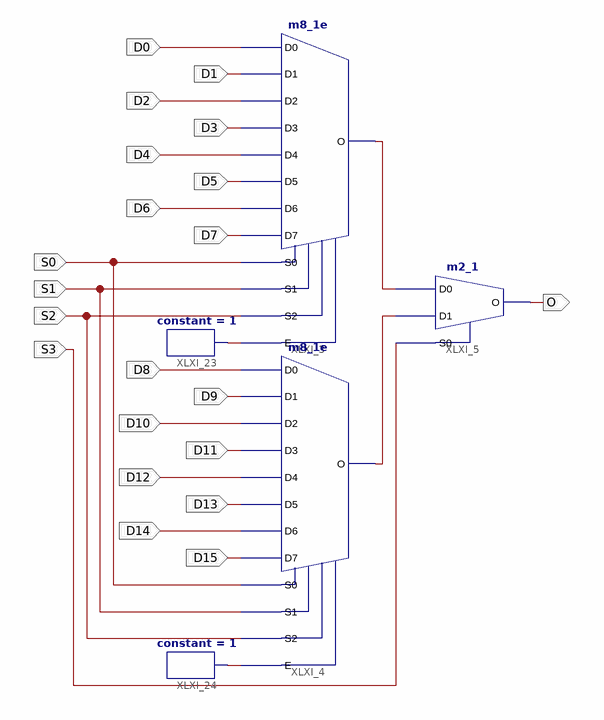
[diagram p0: schematic sheet 1]
// Xilinx ISE schematic Rom16x1.sch (virtex6) as structural Verilog: 5 symbols, 21 ports
module Rom16x1 (
  input  D1,
  input  D0,
  input  D2,
  input  D3,
  input  D4,
  input  D5,
  input  D6,
  input  D7,
  input  D8,
  input  D9,
  input  D10,
  input  D11,
  input  D12,
  input  D13,
  input  D14,
  input  D15,
  input  S0,
  input  S1,
  input  S2,
  input  S3,
  output O
);

  wire XLXN_1, XLXN_2, XLXN_20, XLXN_21;

  m8_1e XLXI_3 (
    .D0(D0), .D1(D1), .D2(D2), .D3(D3), .D4(D4), .D5(D5), .D6(D6), .D7(D7), .E(XLXN_20), .S0(S0), .S1(S1),
    .S2(S2), .O(XLXN_2));
  m8_1e XLXI_4 (
    .D0(D8), .D1(D9), .D2(D10), .D3(D11), .D4(D12), .D5(D13), .D6(D14), .D7(D15), .E(XLXN_21), .S0(S0),
    .S1(S1), .S2(S2), .O(XLXN_1));
  m2_1 XLXI_5 (.D0(XLXN_2), .D1(XLXN_1), .S0(S3), .O(O));
  constant #(.CValue("1")) XLXI_23 (.O(XLXN_20));
  constant #(.CValue("1")) XLXI_24 (.O(XLXN_21));
endmodule
